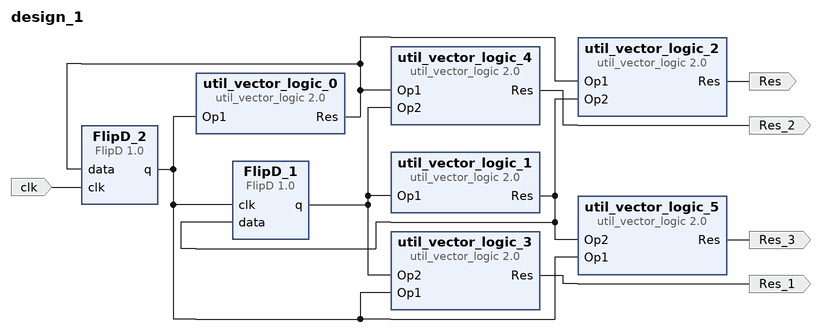
[diagram p0: block diagram of the top level]
# Vivado block design design_1, xc7a35tcsg324-3, Vivado 2020.1
create_bd_design design_1

create_bd_port -dir O -type data Res
create_bd_port -dir O -type data Res_1
create_bd_port -dir O -type data Res_3
create_bd_port -dir O -type data Res_2
create_bd_port -dir I -type clk clk
set_property -dict {CONFIG.FREQ_HZ 100000000} [get_bd_ports clk]

create_bd_cell -type ip -vlnv xilinx.com:user:FlipD:1.0 FlipD_1
create_bd_cell -type ip -vlnv xilinx.com:user:FlipD:1.0 FlipD_2
create_bd_cell -type ip -vlnv xilinx.com:ip:util_vector_logic:2.0 util_vector_logic_0
set_property -dict {CONFIG.C_OPERATION not CONFIG.C_SIZE 1} [get_bd_cells util_vector_logic_0]
create_bd_cell -type ip -vlnv xilinx.com:ip:util_vector_logic:2.0 util_vector_logic_1
set_property -dict {CONFIG.C_OPERATION not CONFIG.C_SIZE 1} [get_bd_cells util_vector_logic_1]
create_bd_cell -type ip -vlnv xilinx.com:ip:util_vector_logic:2.0 util_vector_logic_2
set_property -dict {CONFIG.C_SIZE 1} [get_bd_cells util_vector_logic_2]
create_bd_cell -type ip -vlnv xilinx.com:ip:util_vector_logic:2.0 util_vector_logic_3
set_property -dict {CONFIG.C_SIZE 1} [get_bd_cells util_vector_logic_3]
create_bd_cell -type ip -vlnv xilinx.com:ip:util_vector_logic:2.0 util_vector_logic_4
set_property -dict {CONFIG.C_SIZE 1} [get_bd_cells util_vector_logic_4]
create_bd_cell -type ip -vlnv xilinx.com:ip:util_vector_logic:2.0 util_vector_logic_5
set_property -dict {CONFIG.C_SIZE 1} [get_bd_cells util_vector_logic_5]

# ---- connections ----

connect_bd_net [get_bd_pins FlipD_1/q] \
  [get_bd_pins util_vector_logic_1/Op1] [get_bd_pins util_vector_logic_3/Op2] [get_bd_pins util_vector_logic_4/Op2]
connect_bd_net [get_bd_pins util_vector_logic_0/Res] \
  [get_bd_pins util_vector_logic_2/Op1] [get_bd_pins FlipD_2/data] [get_bd_pins util_vector_logic_4/Op1]
connect_bd_net [get_bd_pins util_vector_logic_1/Res] \
  [get_bd_pins util_vector_logic_2/Op2] [get_bd_pins FlipD_1/data] [get_bd_pins util_vector_logic_5/Op2]
connect_bd_net [get_bd_pins FlipD_2/q] \
  [get_bd_pins util_vector_logic_0/Op1] [get_bd_pins FlipD_1/clk] [get_bd_pins util_vector_logic_3/Op1] \
  [get_bd_pins util_vector_logic_5/Op1]
connect_bd_net [get_bd_pins util_vector_logic_2/Res] [get_bd_ports Res]
connect_bd_net [get_bd_pins util_vector_logic_3/Res] [get_bd_ports Res_1]
connect_bd_net [get_bd_pins util_vector_logic_5/Res] [get_bd_ports Res_3]
connect_bd_net [get_bd_pins util_vector_logic_4/Res] [get_bd_ports Res_2]
connect_bd_net [get_bd_ports clk] [get_bd_pins FlipD_2/clk]

validate_bd_design
save_bd_design
